# EasyEDA Pro project ProProject_基于CW32单片机的旋转变压器软件解码_2024-01-24.epro

# Schematic 基于CW32单片机的旋转变压器软件解码
Create Date: 2024-01-16; Page Name: 基于CW32单片机的墙体探测仪; Project Name: 基于CW32单片机的旋转变压器软件解码; Schematic Name: 基于CW32单片机的旋转变压器软件解码; Update Date: 2024-01-24; Company: 嘉立创EDA; Page Size: A2; Version: V1.0
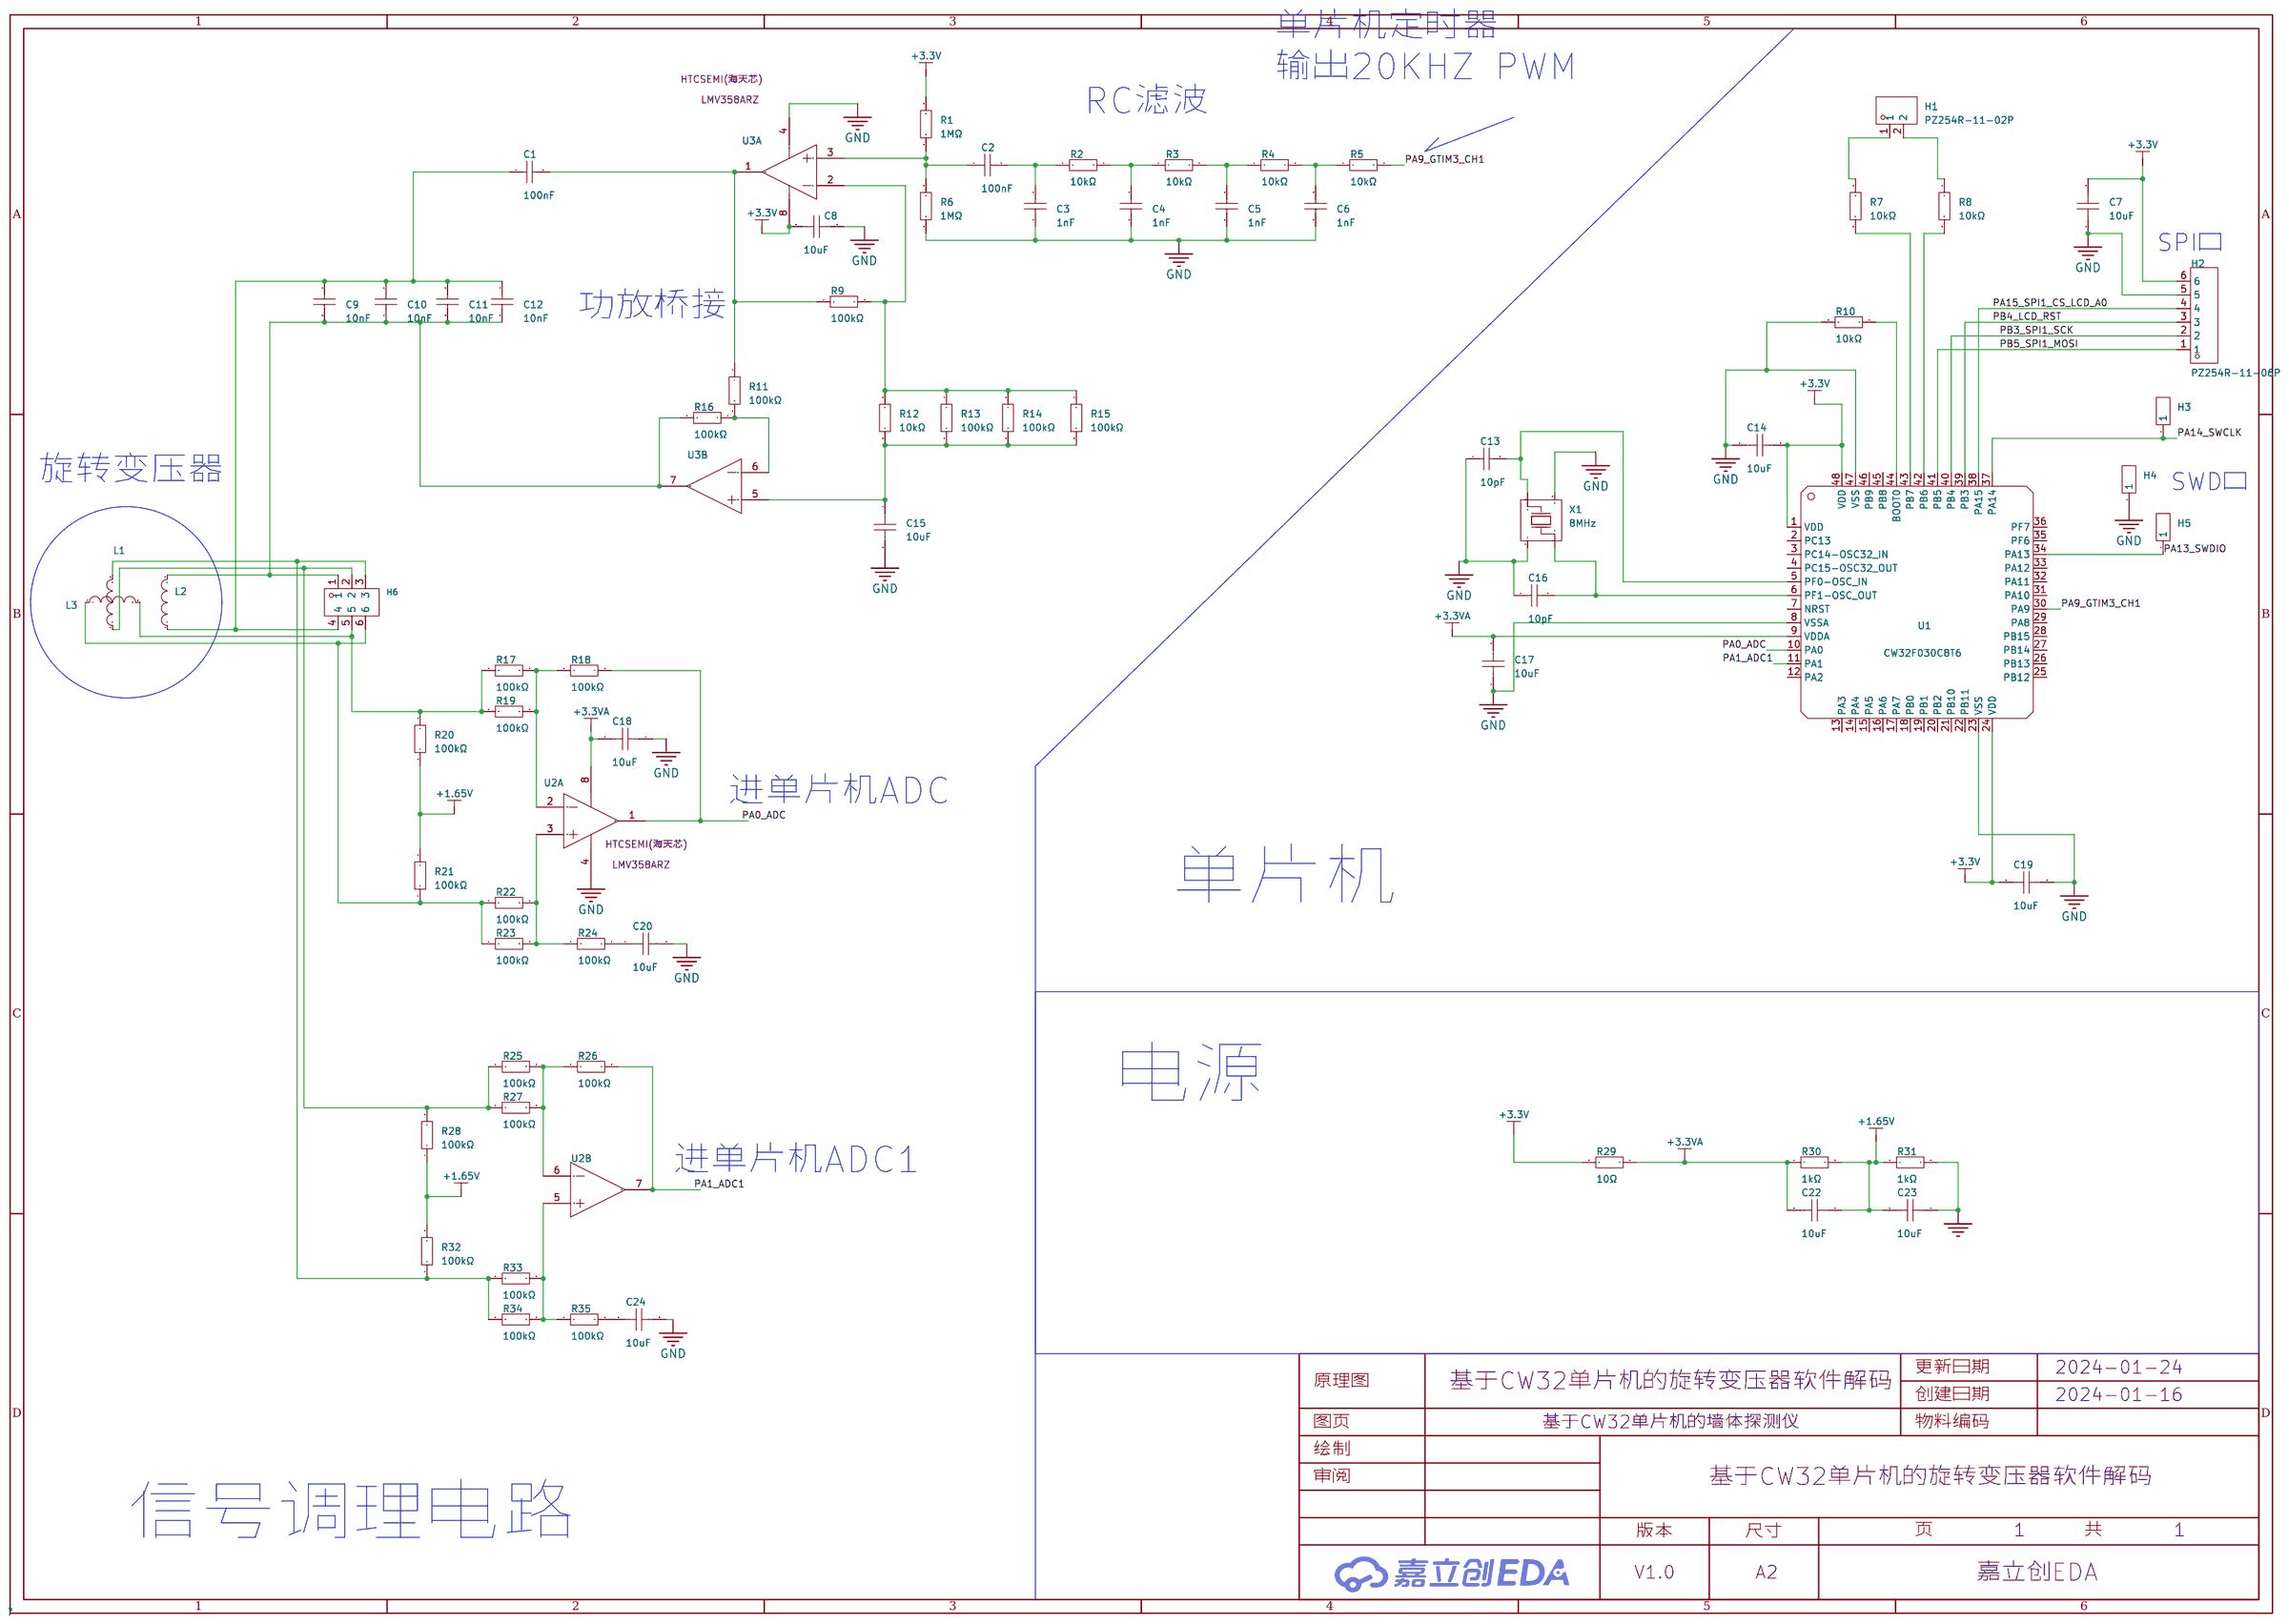
[diagram p0: schematic sheet]

## Parts
C1  100nF  [C0603]
C2  100nF  [C0603]
C3  1nF  [C0603]
C4  1nF  [C0603]
C5  1nF  [C0603]
C6  1nF  [C0603]
C7  10uF  [C0603]
C8  10uF  [C0603]
C9  10nF  [C0603]
C10  10nF  [C0603]
C11  10nF  [C0603]
C12  10nF  [C0603]
C13  10pF  [C0603]
C14  10uF  [C0603]
C15  10uF  [C0603]
C16  10pF  [C0603]
C17  10uF  [C0603]
C18  10uF  [C0603]
C19  10uF  [C0603]
C20  10uF  [C0603]
C22  10uF  [C0603]
C23  10uF  [C0603]
C24  10uF  [C0603]
H1  PZ254R-11-02P  [HDR-TH_2P-P2.54-H-M-W10.4]
H2  PZ254R-11-06P  [HDR-TH_6P-P2.54-H-M-W10.4]
H3  -  [HDR-TH_1P-V-M_XKB_X4611WV-01I-C28D40]
H4  -  [HDR-TH_1P-V-M_XKB_X4611WV-01I-C28D40]
H5  -  [HDR-TH_1P-V-M_XKB_X4611WV-01I-C28D40]
H6  PZ254-2-03-Z-8.5  [HDR-TH_6P-P2.54-V-M-R2-C3-S2.54]
L1  10uH  [L1206]
L2  6.3uH  [L1206]
L3  10uH  [L1206]
R1  1MΩ  [R0603]
R2  10kΩ  [R0603]
R3  10kΩ  [R0603]
R4  10kΩ  [R0603]
R5  10kΩ  [R0603]
R6  1MΩ  [R0603]
R7  10kΩ  [R0603]
R8  10kΩ  [R0603]
R9  100kΩ  [R0603]
R10  10kΩ  [R0603]
R11  100kΩ  [R0603]
R12  10kΩ  [R0603]
R13  100kΩ  [R0603]
R14  100kΩ  [R0603]
R15  100kΩ  [R0603]
R16  100kΩ  [R0603]
R17  100kΩ  [R0603]
R18  100kΩ  [R0603]
R19  100kΩ  [R0603]
R20  100kΩ  [R0603]
R21  100kΩ  [R0603]
R22  100kΩ  [R0603]
R23  100kΩ  [R0603]
R24  100kΩ  [R0603]
R25  100kΩ  [R0603]
R26  100kΩ  [R0603]
R27  100kΩ  [R0603]
R28  100kΩ  [R0603]
R29  10Ω  [R0603]
R30  1kΩ  [R0603]
R31  1kΩ  [R0603]
R32  100kΩ  [R0603]
R33  100kΩ  [R0603]
R34  100kΩ  [R0603]
R35  100kΩ  [R0603]
U1  CW32F030C8T6  [LQFP-48_L7.0-W7.0-P0.50-LS9.0-TL]
U2  -  [SOP-8_L4.9-W3.9-P1.27-LS6.0-BL]  (sections 1,2)
U3  -  [SOP-8_L4.9-W3.9-P1.27-LS6.0-BL]  (sections 1,2)
X1  8MHz  [OSC-SMD_4P-L3.2-W2.5-BL]

## Library data of the parts
C1 C2 = 0603B104K500NT: 容值:100nF;精度:±10%;额定电压:50V;材质(温度系数):X7R;; LCSC Part Name: 100nF ±10% 50V; Supplier Part: C30926; Manufacturer: FH(风华); Supplier Footprint: 0603; JLCPCB Part Class: Extended Part; Datasheet: https://atta.szlcsc.com/upload/public/pdf/source/20200305/C486355_26A10D38EF8C2A5C37091D0039909270.pdf; Supplier: LCSC; Tolerance: ±10%; Voltage Rated: 50V; Temperature Coefficient: X7R
C3-C6 = CC0603JRNPO9BN102: 容值:1nF;精度:±5%;额定电压:50V;材质(温度系数):NP0;; LCSC Part Name: 1nF±5%50V; Supplier Part: C106246; Manufacturer: YAGEO(国巨); Supplier Footprint: 0603; JLCPCB Part Class: ExtendedPart; Datasheet: https://atta.szlcsc.com/upload/public/pdf/source/20170505/1493957838062.pdf; Supplier: LCSC; Tolerance: ±5%; Voltage Rated: 50V; Temperature Coefficient: NP0
C7 C8 C14 C15 C17-C20 C22-C24 = CL10A106KP8NNNC: 容值:10uF;精度:±10%;额定电压:10V;材质(温度系数):X5R;; LCSC Part Name: 10uF±10%10V; Supplier Part: C19702; Manufacturer: SAMSUNG(三星); Supplier Footprint: 0603; JLCPCB Part Class: BasicPart; Datasheet: https://atta.szlcsc.com/upload/public/pdf/source/20160103/1457707703378.pdf; Supplier: LCSC; Tolerance: ±10%; Voltage Rated: 10V; Temperature Coefficient: X5R
C9-C12 = CC0603KRX7R9BB103: 容值:10nF;精度:±10%;额定电压:50V;材质(温度系数):X7R;; LCSC Part Name: 10nF ±10% 50V; Supplier Part: C100042; Manufacturer: YAGEO(国巨); Supplier Footprint: 0603; JLCPCB Part Class: 扩展库; Datasheet: https://atta.szlcsc.com/upload/public/pdf/source/20181008/C309510_22F155564471FAF6A489F7D68F34234E.pdf; Supplier: LCSC; Tolerance: ±10%; Voltage Rated: 50V; Temperature Coefficient: X7R
C13 C16 = CC0603JRNPO9BN100: 容值:10pF;精度:±5%;额定电压:50V;材质(温度系数):NP0;; LCSC Part Name: 10pF±5%50V; Supplier Part: C106245; Manufacturer: YAGEO(国巨); Supplier Footprint: 0603; JLCPCB Part Class: ExtendedPart; Datasheet: https://atta.szlcsc.com/upload/public/pdf/source/20170505/1493957837406.pdf; Supplier: LCSC; Tolerance: ±5%; Voltage Rated: 50V; Temperature Coefficient: NP0
H1 = PZ254R-11-02P: 插针结构:1x2P;间距:2.54mm;行距:-;圆针/方针:方针;安装类型:弯插;排数:单排;总PIN位数:2P;额定电流:-;额定电压:-;配合针长度:6mm;塑高:2.5mm;触头材质:黄铜;触头镀层:-;工作温度范围:-40℃~+105℃;颜色:黑色;; LCSC Part Name: 间距:2.54mm 1x2P 弯插 方针; Supplier Part: C492410; Manufacturer: XFCN(兴飞); Supplier Footprint: 弯插,P=2.54mm; JLCPCB Part Class: 扩展库; Datasheet: https://atta.szlcsc.com/upload/public/pdf/source/20200309/C492410_AD20A982E51A4870F6FD4D2413672598.pdf; Supplier: LCSC; Pin Structure: 1x2P; Pitch: 2.54mm; Circluar Pins/Square Pins: 方针; Mounting Type: 弯插; Number of Rows: 单排; Number of Pins: 2P; Length of Mating Pin: 6mm; Insulation Height: 2.5mm; Contact Material: 黄铜; Operating Temperature Range: -40℃~+105℃; Color: 黑色
H2 = PZ254R-11-06P: 插针结构:1x6P;间距:2.54mm;行距:-;圆针/方针:方针;安装类型:弯插;排数:单排;总PIN位数:6P;额定电流:-;额定电压:-;配合针长度:6mm;塑高:2.5mm;触头材质:黄铜;触头镀层:-;工作温度范围:-40℃~+105℃;颜色:黑色;; LCSC Part Name: 间距:2.54mm 1x6P 弯插 方针; Supplier Part: C492414; Manufacturer: XFCN(兴飞); Supplier Footprint: 弯插,P=2.54mm; JLCPCB Part Class: 扩展库; Datasheet: https://atta.szlcsc.com/upload/public/pdf/source/20200309/C492414_188252315A8FC19F8382BF484DD4F4B8.pdf; Supplier: LCSC; Pin Structure: 1x6P; Pitch: 2.54mm; Circluar Pins/Square Pins: 方针; Mounting Type: 弯插; Number of Rows: 单排; Number of Pins: 6P; Length of Mating Pin: 6mm; Insulation Height: 2.5mm; Contact Material: 黄铜; Operating Temperature Range: -40℃~+105℃; Color: 黑色
H3-H5 = HDR-M_2.54_1x1P: Supplier Part: C81276; Supplier Footprint: 插件; JLCPCB Part Class: ExtendedPart
H6 = PZ254-2-03-Z-8.5_C2894964: 排数:双排;总PIN位数:6;间距:2.54mm;插针结构:2x3P;行距:2.54mm;安装类型:直插;圆针/方针:方针;额定电流:3A;额定电压:-;配合针长度:6mm;塑高:2.5mm;端接针长度:3mm;触头材质:-;工作温度范围:-40℃~+105℃;颜色:黑色;; Supplier: LCSC; Supplier Part: C2894964; Manufacturer: HCTL(华灿天禄); JLCPCB Part Class: 扩展库; LCSC Part Name: 2.54mm 2x3P 直插 方针; Supplier Footprint: 直插,P=2.54mm; Number of Rows: 双排; Number of Pins: 6; Pitch: 2.54mm; Pin Structure: 2x3P; Row Spacing: 2.54mm; Mounting Type: 直插; Circluar Pins/Square Pins: 方针; Current Rating (Max): 3A; Length of Mating Pin: 6mm; Insulation Height: 2.5mm; Length of End Connection Pin: 3mm; Operating Temperature Range: -40℃~+105℃; Color: 黑色
L1-L3 = L_1206
R1 R6 = 0603WAF1004T5E: 电阻类型:厚膜电阻;阻值:1MΩ;精度:±1%;功率:100mW;; LCSC Part Name: 1MΩ±1%100mW; Supplier Part: C22935; Manufacturer: UNI-ROYAL(厚声); Supplier Footprint: 0603; JLCPCB Part Class: BasicPart; Datasheet: https://atta.szlcsc.com/upload/public/pdf/source/20200306/C422600_1E6D84923E4A46A82E41ADD87F860B5C.pdf; Supplier: LCSC; Type: 厚膜电阻; Tolerance: ±1%; Power(Watts): 100mW; Temperature Coefficient: ±100ppm/℃; Overload Voltage (Max): 75V; Operating Temperature Range: -55℃~+155℃
R2-R5 R7 R8 R10 R12 = RC0603FR-0710KL: 电阻类型:厚膜电阻;阻值:10kΩ;精度:±1%;功率:100mW;; LCSC Part Name: 10kΩ±1%100mW; Supplier Part: C98220; Manufacturer: YAGEO(国巨); Supplier Footprint: 0603; JLCPCB Part Class: ExtendedPart; Datasheet: https://atta.szlcsc.com/upload/public/pdf/source/20170522/1495423494387.pdf; Supplier: LCSC; Type: 厚膜电阻; Tolerance: ±1%; Power(Watts): 100mW; Temperature Coefficient: ±100ppm/℃; Overload Voltage (Max): 75V; Operating Temperature Range: -55℃~+155℃
R9 R11 R13-R28 R32-R35 = RC0603FR-07100KL: 电阻类型:厚膜电阻;阻值:100kΩ;精度:±1%;功率:100mW;; LCSC Part Name: 100kΩ±1%100mW; Supplier Part: C14675; Manufacturer: YAGEO(国巨); Supplier Footprint: 0603; JLCPCB Part Class: ExtendedPart; Datasheet: https://atta.szlcsc.com/upload/public/pdf/source/20140324/1457707028752.pdf; Supplier: LCSC; Type: 厚膜电阻; Tolerance: ±1%; Power(Watts): 100mW; Temperature Coefficient: ±100ppm/℃; Overload Voltage (Max): 75V; Operating Temperature Range: -55℃~+155℃
R29 = 0603WAF100JT5E: 电阻类型:厚膜电阻;阻值:10Ω;精度:±1%;功率:100mW;; LCSC Part Name: 10Ω±1%100mW; Supplier Part: C22859; Manufacturer: UNI-ROYAL(厚声); Supplier Footprint: 0603; JLCPCB Part Class: BasicPart; Datasheet: https://atta.szlcsc.com/upload/public/pdf/source/20200306/C422600_1E6D84923E4A46A82E41ADD87F860B5C.pdf; Supplier: LCSC; Type: 厚膜电阻; Tolerance: ±1%; Power(Watts): 100mW; Temperature Coefficient: ±400ppm/℃; Overload Voltage (Max): 75V; Operating Temperature Range: -55℃~+155℃
R30 R31 = RC0603FR-071KL: 电阻类型:厚膜电阻;阻值:1kΩ;精度:±1%;功率:100mW;; LCSC Part Name: 1kΩ±1%100mW; Supplier Part: C22548; Manufacturer: YAGEO(国巨); Supplier Footprint: 0603; JLCPCB Part Class: ExtendedPart; Datasheet: https://atta.szlcsc.com/upload/public/pdf/source/20180312/7BD3618A8B6324EA6280B0497A051AB7.pdf; Supplier: LCSC; Type: 厚膜电阻; Tolerance: ±1%; Power(Watts): 100mW; Temperature Coefficient: ±100ppm/℃; Overload Voltage (Max): 75V; Operating Temperature Range: -55℃~+155℃
U1 = CW32F030C8T6_C3019113: CPU内核:ARMCortex-M0+;CPU最大主频:64MHz;工作电压范围:1.65V~5.5V;内部振荡器:有;外部时钟频率范围:4MHz~32MHz;程序FLASH容量:-;RAM总容量:8KB;EEPROM/数据FLASH容量:-;GPIO端口数量:39;ADC(单元数/通道数/位数):1@x16ch/12bit;DAC(单元数/通道数/位数):-;(E)PWM(单元数/通道数/位数):-;8位Timer数量:-;16位Timer数量:8;32位Timer数量:-;内部比较器数量:2;U; LCSC Part Name: ARMCortex-M0+64MHzRAM：8KB; Supplier Part: C3019113; Manufacturer: CW(芯源); Supplier Footprint: LQFP-48; JLCPCB Part Class: ExtendedPart; Datasheet: https://atta.szlcsc.com/upload/public/pdf/source/20220516/D60F5E1023A73FFF550D4A77416DDFBC.pdf; Supplier: LCSC; CPU Core: ARMCortex-M0+; Maximum Frequency: 64MHz; Supply Voltage Range: 1.65V~5.5V; Internal Oscillator: 有; External Clock Frequency Rang: 4MHz~32MHz; RAM Size: 8KB; GPIO Ports Number: 39; ADC (Units/Channels/bits): 1@x16ch/12bit; 16Bit Timer Number: 8; CMP Number: 2; U(S)ART Number: 3; I2C Number: 2; (Q)SPI Number: 2; Peripherals / Functions / Protocol Stacks: 片载温度传感器；DMA；看门狗；低电压检测；CRC校验; Operating Temperature Range: -40℃~105℃
U2 U3 = LMV358ARZ: CMOS低功耗双路运算放大器; Supplier Part: C2928823; Manufacturer: HTCSEMI(海天芯); Supplier Footprint: SOP-8; JLCPCB Part Class: ExtendedPart; Datasheet: https://atta.szlcsc.com/upload/public/pdf/source/20220114/2D4B849A76DE33264688A93B3A90A0F8.pdf; Supplier: LCSC
X1 = TAXM8M4RDBCCT2T: 频率:8MHz;负载电容:10pF;频率公差:±10ppm;; LCSC Part Name: 8MHz ±10ppm 10pF; Supplier Part: C400090; Manufacturer: YJX(雅晶鑫); Supplier Footprint: SMD3225-4P; JLCPCB Part Class: 扩展库; Datasheet: https://atta.szlcsc.com/upload/public/pdf/source/20190626/C400090_CF95B89E745AFE4EF2E392EF8AC009D6.pdf; Supplier: LCSC; Crystal Type: 贴片无源晶振; Load Capacitance: 10pF; Equivalent Series Resistance (ESR): 250Ω; Frequency Tolerance: ±10ppm; Frequency Stability: ±15ppm; Operating Temperature: -40℃~+85℃

## Nets
+1.65V: C22.1 C23.2 R20.1 R21.2 R28.1 R30.2 R31.1 R32.2
+3.3V: C7.2 C8.2 C14.2 C19.1 H2.6 R1.2 R29.2 U1.1(VDD) U1.24(VDD) U1.48(VDD) U3.8(VCC)
+3.3VA: C17.2 C18.2 C22.2 R29.1 R30.1 U1.9(VDDA) U2.8(VCC)
GND: C3.1 C4.1 C5.1 C6.1 C7.1 C8.1 C13.1 C14.1 C15.2 C16.1 C17.1 C18.1 C19.2 C20.2 C23.1 C24.2 H2.5 H4.1 R6.1 R10.2 R31.2 U1.8(VSSA) U1.23(VSS) U1.47(VSS) U2.4(GND) U3.4(GND) X1.2 X1.4
PA0_ADC: R18.2 U1.10(PA0) U2.1(OUT)
PA1_ADC1: R26.2 U1.11(PA1) U2.7(OUT2)
PA9_GTIM3_CH1: R5.2 U1.30(PA9)
PA13_SWDIO: H5.1 U1.34(PA13)
PA14_SWCLK: H3.1 U1.37(PA14)
PA15_SPI1_CS_LCD_A0: H2.4 U1.38(PA15)
PB3_SPI1_SCK: H2.2 U1.40(PB4)
PB4_LCD_RST: H2.3 U1.39(PB3)
PB5_SPI1_MOSI: H2.1 U1.41(PB5)
$1N206778: R10.1 U1.44(BOOT0)
$1N234147: R7.2 U1.43(PB7)
$1N234151: R8.2 U1.42(PB6)
$1N256375: C4.2 R2.2 R3.1
$1N256389: C5.2 R3.2 R4.1
$1N256398: C6.2 R4.2 R5.1
$1N256743: C2.2 C3.2 R2.1
$1N263980: C2.1 R1.1 R6.2 U3.3(IN1+)
$1N291348: R11.2 R16.1 U3.6(IN2-)
$1N303075: C1.2 R9.1 R11.1 U3.1(OUT)
$1N308887: R9.2 R12.2 R13.1 R14.1 R15.1 U3.2(IN1-)
$1N309457: C15.1 R12.1 R13.2 R14.2 R15.2 U3.5(IN2+)
$1N317446: R17.2 R18.1 R19.2 U2.2(IN1-)
$1N317450: R22.2 R23.2 R24.1 U2.3(IN1+)
$1N317574: C20.1 R24.2
$1N317615: C24.1 R35.2
$1N317627: R25.2 R26.1 R27.2 U2.6(IN2-)
$1N317631: R33.2 R34.2 R35.1 U2.5(IN2+)
$1N320492: C13.2 U1.5(PF0-OSC_IN) X1.3
$1N320508: C16.2 U1.6(PF1-OSC_OUT) X1.1
$1N325322: H1.1 R7.1
$1N325327: H1.2 R8.1
Net-(C1-1): C1.1 C9.2 C10.2 C11.2 C12.2 H6.4 L2.1
Net-(C9-1): C9.1 C10.1 C11.1 C12.1 H6.1 L2.2 R16.2 U3.7(OUT2)
Net-(H6-2): H6.2 L1.1 R25.1 R27.1 R28.2
Net-(H6-3): H6.3 L1.2 R32.1 R33.1 R34.1
Net-(H6-5): H6.5 L3.2 R17.1 R19.1 R20.2
Net-(H6-6): H6.6 L3.1 R21.1 R22.1 R23.1

Not connected (* = marked no-connect by the designer): U1 2(PC13) 3(PC14-OSC32_IN) 4(PC15-OSC32_OUT) 7(NRST) 12(PA2) 13(PA3) 14(PA4) 15(PA5) 16(PA6) 17(PA7) 18(PB0) 19(PB1) 20(PB2) 21(PB10) 22(PB11) 25(PB12) 26(PB13) 27(PB14) 28(PB15) 29(PA8) 31(PA10) 32(PA11) 33(PA12) 35(PF6) 36(PF7) 45(PB8) 46(PB9)

## Notes on the sheet
- 单片机定时器
  输出20KHZ PWM
- RC滤波
- SPI口
- 功放桥接
- 旋转变压器
- SWD口
- 进单片机ADC
- 单片机
- 电源
- 进单片机ADC1
- 信号调理电路

# Board PCB3
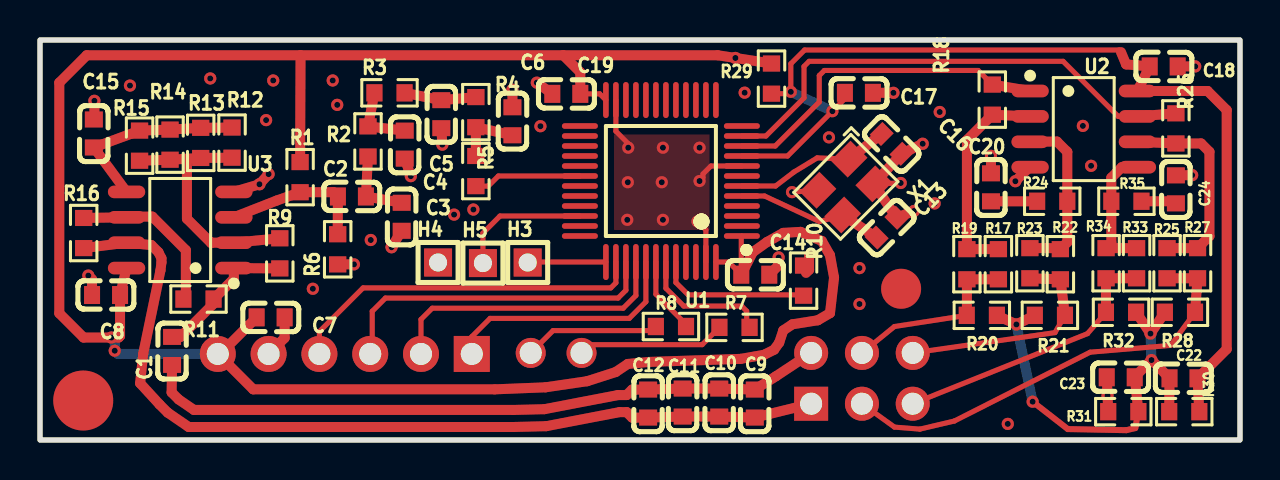
[diagram p1: board, top side]
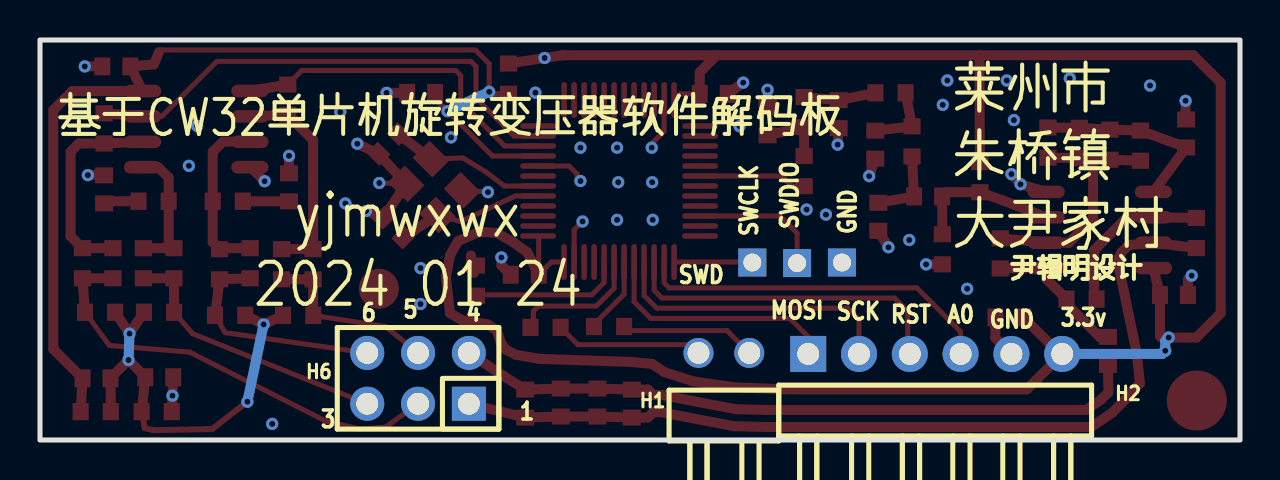
[diagram p2: board, bottom side, seen from below]

Outline 60 x 20 mm; copper layers: Top Layer, Bottom Layer. Coordinates in mm from the lower left corner of the outline.
Outline path: rectangle 0,20 60,0
Stack: Top Layer 0.035mm / Dielectric1 1.51mm FR4 er 4.5 / Bottom Layer 0.035mm

## Design rules (mm)
net $1N325463: DP1
net $1N325488: DP1
template: 自定义配置
spacing copperThickness1oz (default): track to track 0.102, other pairs 0.152 to 0.3
spacing copperThickness2oz: track to track 0.203, other pairs 0.152 to 0.3
track width copperThickness1oz (default): min 0.127, default 0.254, max 2.54
track width copperThickness2oz: min 0.203, default 0.254, max 2.54
differential pair differentialPair (default): width min 0.127, default 0.254, max 2.54; gap min 0.152, default 0.152
via viaSize (default): diameter min 0.5, default 0.61, max 10; hole min 0.3, default 0.305, max 6.3

## Placement (name value [footprint] x y rotation side)
C1  100nF  [C0603]  6.6 4.45 90 top
C2  100nF  [C0603]  15.6 12.18 0 top
C3  1nF  [C0603]  18.09 11.16 90 top
C4  1nF  [C0603]  18.24 14.77 90 top
C5  1nF  [C0603]  20.07 16.29 90 top
C6  1nF  [C0603]  23.62 15.94 270 top
C7  10uF  [C0603]  11.53 6.13 180 top
C8  10uF  [C0603]  3.3 7.25 0 top
C9  10nF  [C0603]  35.74 1.82 90 top
C10  10nF  [C0603]  33.96 1.87 90 top
C11  10nF  [C0603]  32.13 1.87 90 top
C12  10nF  [C0603]  30.41 1.82 90 top
C13  10pF  [C0603]  42.33 10.62 225 top
C14  10uF  [C0603]  35.76 8.27 180 top
C15  10uF  [C0603]  2.69 15.33 90 top
C16  10pF  [C0603]  42.58 14.81 135 top
C17  10uF  [C0603]  40.94 17.36 180 top
C18  10uF  [C0603]  56.19 18.68 180 top
C19  10uF  [C0603]  26.31 17.31 180 top
C20  10uF  [C0603]  47.55 12.63 90 top
C22  10uF  [C0603]  57.18 3.08 0 top
C23  10uF  [C0603]  54.04 3.14 0 top
C24  10uF  [C0603]  56.79 12.53 90 top
H1  PZ254R-11-02P  [hdr-th_2p-p2.54-h-m-w10.4]  25.81 4.35 180 bottom
H2  PZ254R-11-06P  [HDR-TH_6P-P2.54-H-M-W10.4]  15.24 4.3 180 bottom
H3  -  [HDR-TH_1P-V-M_XKB_X4611WV-01I-C28D40]  24.38 8.88 0 top
H4  -  [HDR-TH_1P-V-M_XKB_X4611WV-01I-C28D40]  19.9 8.88 0 top
H5  -  [HDR-TH_1P-V-M_XKB_X4611WV-01I-C28D40]  22.15 8.85 0 top
H6  PZ254-2-03-Z-8.5  [HDR-TH_6P-P2.54-V-M-R2-C3-S2.54]  41.1 3.08 0 bottom
NOREF  -  [Pad_e2014]  2.16 1.97 180 top
NOREF#2  -  [Pad_e2016]  43.06 7.56 180 top
R1  1MΩ  [R0603]  13 13.14 90 top
R2  10kΩ  [R0603]  16.4 14.93 90 top
R3  10kΩ  [R0603]  17.47 17.36 0 top
R4  10kΩ  [R0603]  21.79 16.39 270 top
R5  10kΩ  [R0603]  21.79 13.45 270 top
R6  1MΩ  [R0603]  14.88 9.53 90 top
R7  10kΩ  [R0603]  34.72 5.63 0 top
R8  10kΩ  [R0603]  31.55 5.67 0 top
R9  100kΩ  [R0603]  11.99 9.33 90 top
R10  10kΩ  [R0603]  38.18 7.97 90 top
R11  100kΩ  [R0603]  7.92 7.05 180 top
R12  10kΩ  [R0603]  9.6 14.87 270 top
R13  100kΩ  [R0603]  8.03 14.86 90 top
R14  100kΩ  [R0603]  6.5 14.77 90 top
R15  100kΩ  [R0603]  4.98 14.72 90 top
R16  100kΩ  [R0603]  2.18 10.35 270 top
R17  100kΩ  [R0603]  47.92 8.79 90 top
R18  100kΩ  [R0603]  47.62 17.02 90 top
R19  100kΩ  [R0603]  46.34 8.79 90 top
R20  100kΩ  [R0603]  47.09 6.23 180 top
R21  100kΩ  [R0603]  50.5 6.23 180 top
R22  100kΩ  [R0603]  51.02 8.79 90 top
R23  100kΩ  [R0603]  49.49 8.84 90 top
R24  100kΩ  [R0603]  50.61 11.94 180 top
R25  100kΩ  [R0603]  56.35 8.84 90 top
R26  100kΩ  [R0603]  56.79 15.58 90 top
R27  100kΩ  [R0603]  57.88 8.84 90 top
R28  100kΩ  [R0603]  57 6.39 0 top
R29  10Ω  [R0603]  36.58 18.07 90 top
R30  1kΩ  [R0603]  57.21 1.42 180 top
R31  1kΩ  [R0603]  54.16 1.42 180 top
R32  100kΩ  [R0603]  54.05 6.39 0 top
R33  100kΩ  [R0603]  54.83 8.84 90 top
R34  100kΩ  [R0603]  53.3 8.84 90 top
R35  100kΩ  [R0603]  54.32 11.94 0 top
U1  CW32F030C8T6  [LQFP-48_L7.0-W7.0-P0.50-LS9.0-TL]  31.04 12.95 180 top
U2  -  [SOP-8_L4.9-W3.9-P1.27-LS6.0-BL]  52.19 15.55 270 top
U3  -  [SOP-8_L4.9-W3.9-P1.27-LS6.0-BL]  7.01 10.5 90 top
X1  8MHz  [OSC-SMD_4P-L3.2-W2.5-BL]  40.29 12.65 225 top

## Footprints (pads in the part's own frame, mm; a bottom-side part is the same pattern mirrored in y, then rotated)
C0603
  rect 0.8x0.9 smd: 1(-0.7,0) 2(0.7,0)
HDR-TH_1P-V-M_XKB_X4611WV-01I-C28D40
  rect 1.4x1.4 hole 0.9: 1(0,0)
hdr-th_2p-p2.54-h-m-w10.4
  round 1.5 hole 1.1: 1(-1.27,0) 2(1.27,0)
HDR-TH_6P-P2.54-H-M-W10.4
  rect 1.8x1.8 hole 1.1: 1(-6.35,0)
  round 1.8 hole 1.1: 2(-3.81,0) 3(-1.27,0) 4(1.27,0) 5(3.81,0) 6(6.35,0)
HDR-TH_6P-P2.54-V-M-R2-C3-S2.54
  rect 1.7x1.7 hole 1.1: 1(-2.54,1.27)
  round 1.7 hole 1.1: 2(0,1.27) 3(2.54,1.27) 4(-2.54,-1.27) 5(0,-1.27) 6(2.54,-1.27)
LQFP-48_L7.0-W7.0-P0.50-LS9.0-TL
  oval 1.8x0.28 smd: 1(-4.05,2.75) 2(-4.05,2.25) 3(-4.05,1.75) 4(-4.05,1.25) 5(-4.05,0.75) 6(-4.05,0.25) 7(-4.05,-0.25) 8(-4.05,-0.75) 9(-4.05,-1.25) 10(-4.05,-1.75) 11(-4.05,-2.25) 12(-4.05,-2.75) 25(4.05,-2.75) 26(4.05,-2.25) 27(4.05,-1.75) 28(4.05,-1.25) 29(4.05,-0.75) 30(4.05,-0.25) 31(4.05,0.25) 32(4.05,0.75) 33(4.05,1.25) 34(4.05,1.75) 35(4.05,2.25) 36(4.05,2.75)
  oval 0.28x1.8 smd: 13(-2.75,-4.05) 14(-2.25,-4.05) 15(-1.75,-4.05) 16(-1.25,-4.05) 17(-0.75,-4.05) 18(-0.25,-4.05) 19(0.25,-4.05) 20(0.75,-4.05) 21(1.25,-4.05) 22(1.75,-4.05) 23(2.25,-4.05) 24(2.75,-4.05) 37(2.75,4.05) 38(2.25,4.05) 39(1.75,4.05) 40(1.25,4.05) 41(0.75,4.05) 42(0.25,4.05) 43(-0.25,4.05) 44(-0.75,4.05) 45(-1.25,4.05) 46(-1.75,4.05) 47(-2.25,4.05) 48(-2.75,4.05)
OSC-SMD_4P-L3.2-W2.5-BL
  rect 1.4x1.2 smd: 1(-1.1,-0.875) 2(1.1,-0.875) 3(1.1,0.875) 4(-1.1,0.875)
Pad_e2014
  round 3 smd: 1(0,0)
Pad_e2016
  round 2 smd: 2(0,0)
R0603
  rect 0.806x0.864 smd: 1(-0.753,0) 2(0.753,0)
SOP-8_L4.9-W3.9-P1.27-LS6.0-BL
  oval 0.63x1.865 smd: 1(-1.905,-2.683) 2(-0.635,-2.683) 3(0.635,-2.683) 4(1.905,-2.683) 5(1.905,2.683) 6(0.635,2.683) 7(-0.635,2.683) 8(-1.905,2.683)

## Nets
As in the schematic, except:
$1N325227: H6.5 R17.1 R19.1 R20.2
$1N325262: H6.6 R21.1 R22.1 R23.1
$1N325281: H6.2 R25.1 R27.1 R28.2
$1N325303: H6.3 R32.1 R33.1 R34.1
$1N325463: C9.1 C10.1 C11.1 C12.1 H6.1 R16.2 U3.7
$1N325488: C1.1 C9.2 C10.2 C11.2 C12.2 H6.4

Pads without a net: NOREF 1; NOREF#2 2; U1 2 3 4 7 12 13 14 15 16 17 18 19 20 21 22 25 26 27 28 29 31 32 33 35 36 45 46

## Via types
v1: diameter 0.61, hole 0.305, Top Layer to Bottom Layer, 59 vias

## Routing (per net, layer and track width the routed paths; a pad name or vN(x,y) marks a point on that pad's centre or on a via; arc(x,y) is an arc through that point)
+1.65V: length 22.3
  Top Layer w0.3: v1(49.63,1.92) 51.39,0.55 54.31,0.49 54.76,0.59 R31.1
  Top Layer w0.5: R30.2 C22.1 56.48,3.1 v1(55.57,4) 54.74,3.16 C23.2 R31.1 ; R20.1 v1(48.82,5.78) R21.2 ; R28.1 v1(55.52,5.32) R32.2
  Bottom Layer w0.5: v1(55.57,4) v1(55.52,5.32) ; v1(49.63,1.92) v1(48.82,5.78)
+3.3V: length 117.2
  Top Layer w0.254: 28.29,17 27.99,17.31 C19.1 ; U1.1 35.06,10.17 C14.2 34.43,8.9 U1.48
  Top Layer w0.5: C7.2 9,4.3 H2.6 10.66,2.53 22.74,2.53 25.28,2.63 27.36,2.94 28.78,3.4 29.39,3.8 30.46,3.9 35.03,4.06 36.2,4.26 36.71,4.51 36.96,4.87 37.16,5.48 37.62,5.78 38.89,5.99 39.5,6.34 39.7,8.12 39.5,9.24 39.09,9.95 38.03,10.41 37.16,10.36 36.35,9.9 35.64,9.39 C14.2 ; U3.8 C8.2 4,5.2 3.93,5.12 v1(3.57,5.12) 2.18,5.12 0.97,6.33 0.97,17.87 2.34,19.24 13.03,19.24 ; 26.16,19.24 27.01,18.39 C19.1 ; 26.16,19.24 13.03,19.24 ; 26.16,19.24 33.88,19.24 v1(34.77,19.1) R29.2 ; 13.03,19.24 R1.2
  Bottom Layer w0.5: H2.6 3.9,4.3 v1(3.74,4.46) 3.74,4.95 v1(3.57,5.12)
+3.3VA: length 51.9
  Top Layer w0.254: C17.2 40.25,17.06 v1(39.62,16.44) 37.38,14.2 U1.9 ; 54.05,19.39 53.94,19.5 38.23,19.5 37.54,18.81 v1(37.54,17.41) 37.45,17.32 R29.1
  Top Layer w0.5: 54.05,19.39 54.31,18.78 C18.2 U2.8 58.38,17.45 59.33,16.5 59.33,4.54 C22.2 R30.1
  Bottom Layer w0.5: v1(39.62,16.44) v1(37.54,17.41)
GND: length 36.1
  Top Layer w0.254: 33.29,8.9 33.29,10.5 v1(32.87,10.93) ; U1.8 33.55,13.7 33.15,13.3 33.15,13.12 v1(32.98,12.95) ; X1.4 v1(43.04,12.85) ; v1(29.41,14.61) 29.41,14.82 28.79,15.44 U1.23 ; X1.2 v1(37.6,12.39)
  Top Layer w0.5: U2.4 49.47,13.64 v1(48.77,12.94) ; H2.5 12.23,5.1 C7.1 ; v1(2.72,16.96) 2.72,16.05 C15.2 ; C24.2 v1(57.61,13.24) ; v1(42.67,17.36) C17.1 ; 38.46,9.23 38.46,8.51 38.3,8.36 ; C4.1 v1(18.54,13.19) ; C19.2 v1(24.84,17.87) ; C20.2 v1(47.55,14.21) ; C8.1 2.6,8.04 v1(2.42,8.22) ; C5.1 v1(20.12,14.77) ; C6.1 v1(23.62,17.51) ; R6.1 v1(15.7,8.78) ; v1(43.7,11.45) C13.1 X1.4 43.07,14.31 v1(44.14,14.81) ; C14.1 36.93,8.73 v1(36.93,9.13) ; 9.69,12.41 v1(10.97,12.79) v1(11.43,13.29) ; C3.1 v1(17.58,9.64) ; R31.2 v1(53.38,2.22) C23.1 ; C18.1 v1(57.76,18.68)
  vias: v1(4.5,17.72) v1(8.51,18.08) v1(11.31,15.99) v1(11.66,17.98) v1(13.64,7.56) v1(14.63,17.98) v1(14.86,16.76) v1(16.54,10) v1(20.7,11.27) v1(21.67,11.52) v1(25.02,15.69) v1(29.39,12.89) v1(29.36,11.01) v1(31.15,14.61) v1(31.09,12.89) v1(31.15,11.01) v1(32.98,14.61) v1(35.23,17.37) v1(39.45,15.13) v1(40.97,8.59) v1(40.97,6.8) v1(44.73,11.83) v1(44.99,16.4) v1(48.39,0.81) v1(52.14,15.7) v1(52.56,13.71)
PA0_ADC: length 17.1
  Top Layer w0.254: R18.2 46.91,18.48 39.22,18.48 38.96,18.22 38.96,16.9 36.76,14.7 U1.10
  Top Layer w0.5: U2.1 R18.2
PA1_ADC1: length 25.3
  Top Layer w0.254: U1.11 36.3,15.2 38.2,17.1 38.2,18.68 38.46,18.93 51.16,18.93 53.91,16.18 U2.7
  Top Layer w0.5: U2.7 R26.2
PA9_GTIM3_CH1: length 5.4
  Top Layer w0.254: 27,13.2 22.92,13.2 22.41,12.69 R5.2
PA13_SWDIO: length 6.7
  Top Layer w0.254: H5.1 22.15,10.35 23,11.2 27,11.2
PA14_SWCLK: length 3.9
  Top Layer w0.254: 28.29,8.9 24.41,8.9 H3.1
PA15_SPI1_CS_LCD_A0: length 18
  Top Layer w0.254: H2.4 13.97,5.42 16.15,7.61 28.54,7.61 28.79,7.86 U1.38
PB3_SPI1_SCK: length 14.6
  Top Layer w0.254: U1.40 29.79,7.22 29.16,6.59 19.61,6.59 19.05,6.03 H2.2
PB4_LCD_RST: length 16.7
  Top Layer w0.254: H2.3 16.61,4.4 16.61,6.44 17.27,7.1 28.91,7.1 29.29,7.49 29.29,8.9
PB5_SPI1_MOSI: length 12.3
  Top Layer w0.254: H2.1 21.59,5.17 22.5,6.08 29.46,6.08 30.29,6.91 30.29,8.9
$1N206778: length 7.7
  Top Layer w0.254: U1.44 31.79,7.87 32.41,7.26 38.14,7.26 R10.1
$1N234147: length 6.7
  Top Layer w0.254: R7.2 35.33,5.78 35.33,6.44 35.08,6.7 32.18,6.7 31.29,7.59 31.29,8.9
$1N234151: length 3.8
  Top Layer w0.254: R8.2 32.3,5.78 30.79,7.29 U1.42
$1N256375: length 3.6
  Top Layer w0.5: C4.2 R2.2 R3.1
$1N256389: length 3.6
  Top Layer w0.5: R3.2 C5.2 R4.1
$1N256398: length 3.3
  Top Layer w0.5: C6.2 R4.2 R5.1
$1N256743: length 3.8
  Top Layer w0.5: R2.1 C2.2 C3.2
$1N263980: length 7.4
  Top Layer w0.5: R6.2 C2.1 14.68,12.39 R1.1 11.84,11.97 9.69,11.14
$1N291348: length 8.3
  Top Layer w0.5: R11.2 7.29,7.17 7.29,9.49 5.62,11.17 4.36,11.17 U3.6 R16.1
$1N303075: length 7.3
  Top Layer w0.5: C1.2 7.02,5.16 8.68,6.81 R11.1 9.69,8.06 9.69,8.6 R9.1
$1N308887: length 12.8
  Top Layer w0.5: R9.2 9.69,9.87 8.58,9.87 8.56,9.85 7.35,11.06 7.35,14.06 ; 7.35,14.06 R13.1 R12.2 ; 7.35,14.06 R14.1 R15.1
$1N309457: length 9.8
  Top Layer w0.5: U3.5 C15.1 R15.2 R14.2 R13.2 R12.1
$1N317446: length 10.7
  Top Layer w0.5: U2.2 R18.1 46.34,14.99 R19.2 R17.2
$1N317450: length 8.6
  Top Layer w0.5: R23.2 50.97,9.59 R22.2 51.37,9.89 R24.1 51.37,14.41 50.85,14.92 49.51,14.92 U2.3
$1N317574: length 2.3
  Top Layer w0.5: R24.2 49.85,11.93 C20.1
$1N317615: length 1.8
  Top Layer w0.5: C24.1 56.69,11.94 R35.2
$1N317627: length 10.4
  Top Layer w0.5: R25.2 R27.2 58.47,10.19 58.47,14.41 58.06,14.83 R26.1 U2.6
$1N317631: length 6.7
  Top Layer w0.5: U2.5 54.09,13.64 53.57,13.11 R35.1 53.57,9.86 R34.2 R33.2
$1N320492: length 7.4
  Top Layer w0.254: U1.5 36.23,12.2 38.97,10.92 40.13,11.25
  Top Layer w0.5: C13.2 40.13,11.25
$1N320508: length 7.9
  Top Layer w0.254: U1.6 36.78,12.7 37.69,13.4 38.86,14.11 40.45,14.04
  Top Layer w0.5: 42.09,15.3 40.45,14.04
$1N325227: length 9.1
  Top Layer w0.254: H6.5 42.72,5.67 R20.2
  Top Layer w0.5: R20.2 46.34,6.24 R19.1 R17.1
$1N325262: length 11.5
  Top Layer w0.254: H6.6 50.75,5.37 R21.1
  Top Layer w0.5: R23.1 R22.1 R21.1
$1N325281: length 22
  Top Layer w0.254: H6.2 42.72,0.64 43.99,0.54 45.72,0.95 52.51,4.39 56.54,4.73 R28.2
  Top Layer w0.5: R28.2 R27.1 R25.1
$1N325303: length 14.1
  Top Layer w0.254: R32.1 52.38,5.32 H6.3
  Top Layer w0.5: R32.1 53.3,8.08 R34.1 R33.1
$1N325322: length 7.4
  Top Layer w0.254: H1.1 27.49,4.77 33.11,4.77 R7.1
$1N325327: length 6.8
  Top Layer w0.254: H1.2 25.65,5.47 30.59,5.47 R8.1
$1N325463: length 45.3
  Top Layer w0.5: 38.56,1.81 C9.1 C10.1 C11.1 C12.1 29.61,1.12 29.33,1.39 28.98,1.39 25.31,0.69 23.67,0.65 7.44,0.65 6.39,1.37 5.98,1.78 5.01,2.84 5.16,4.31 6.02,8.48 6.07,8.88 6.07,9.09 5.92,9.39 5.56,9.75 U3.7 R16.2
$1N325488: length 34.4
  Top Layer w0.5: C1.1 6.58,2.38 6.94,2.02 7.7,1.5 23.66,1.5 25.22,1.54 28.9,2.25 29.33,2.25 29.61,2.52 C12.2 C11.2 C10.2 C9.2 36.81,3.19 38.56,4.35

## Copper pours and planes (outline as drawn; the poured copper is in the pictures)
GND on Top Layer: 0,20 60,20 60,0 0,0
GND on Top Layer: 28.7,15.28 33.48,15.28 33.48,10.5 28.7,10.5
GND on Bottom Layer: 0,20 60,20 60,0 0,0

## Text on the board
Bottom Silkscreen Layer: SWD | 1 | 4 | 5 | 6 | 3 | GND | SWDIO | SWCLK | 3.3v | A0 | SCK | MOSI | RST | yjmwxwx | 2024 01 24 | 尹辑明设计 | 基于CW32单片机旋转变压器软件解码板 | 莱州市 / 朱桥镇 / 大尹家村
